# Altium schematic sheet MCU.schdoc
size 425 x 281 mm
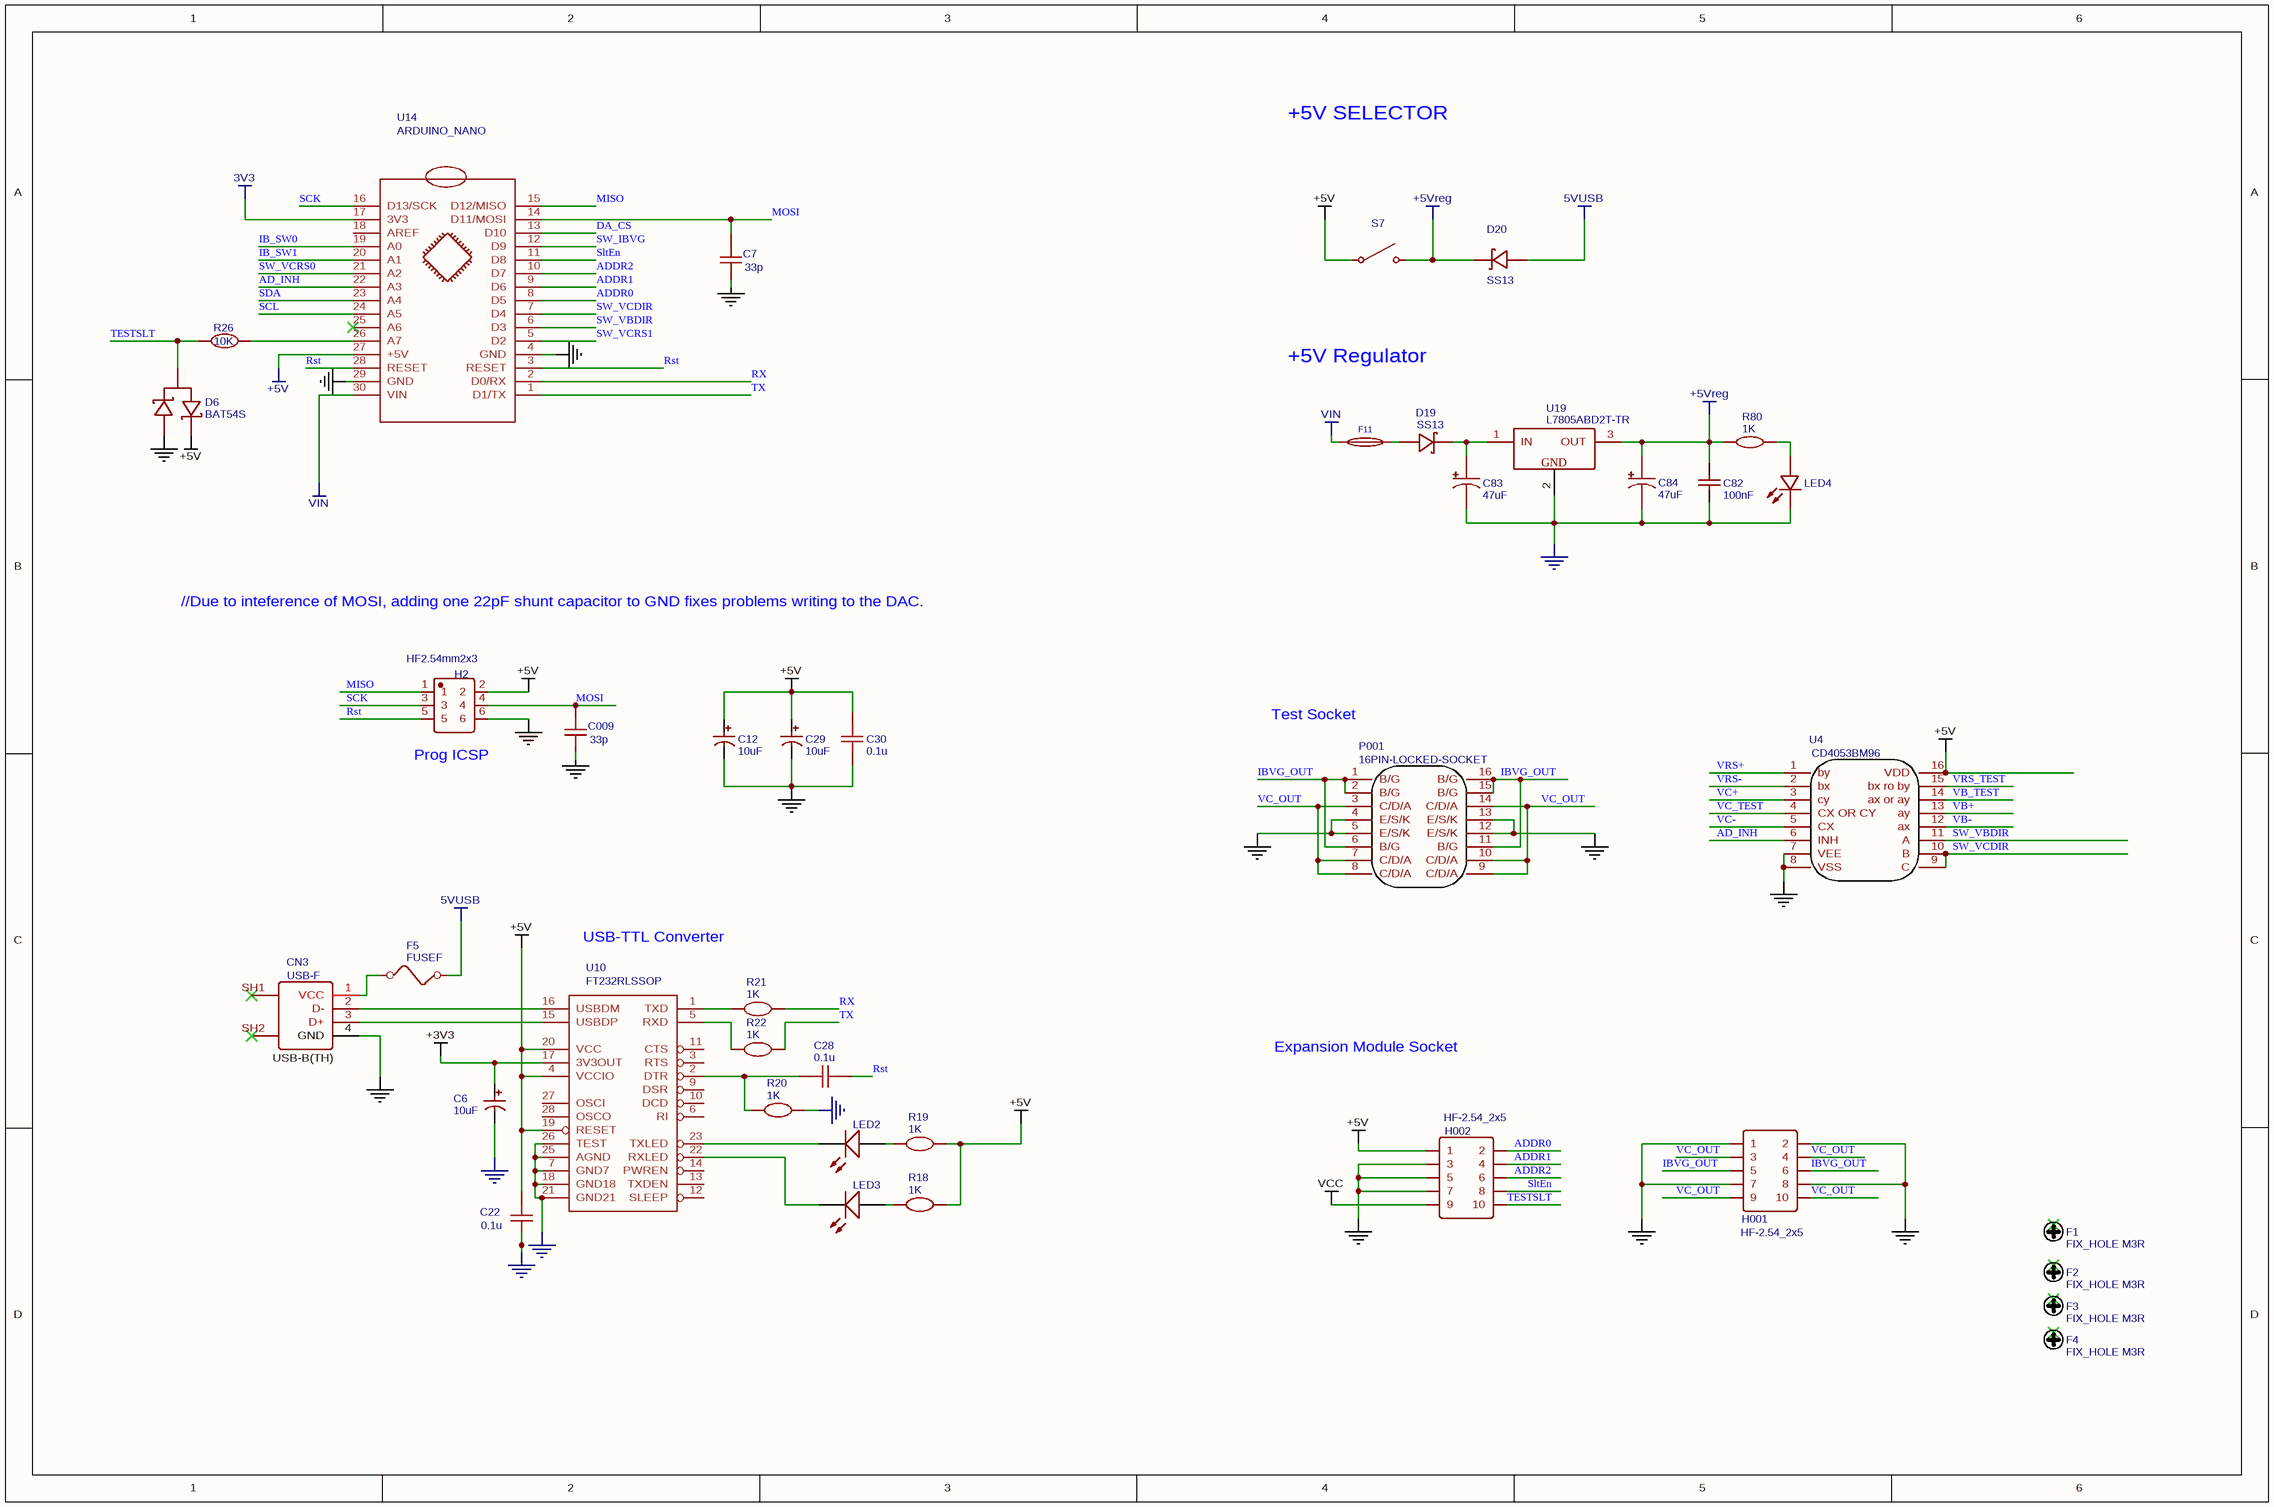
[diagram p0: MCU.schdoc]

## Parts
C6  10uF  [C0805]
C7  33p  [C0805]
C009  33p  [C0805]
C12  10uF  [C0805]
C22  0.1u  [C0805]
C28  0.1u  [C0805]
C29  10uF  [C0805]
C30  0.1u  [C0805]
C82  100nF  [C0603]
C83  47uF  [CAP-SMD_BD6.3-L6.6-W6.6-FD]
C84  47uF  [CAP-SMD_BD6.3-L6.6-W6.6-FD]
CN3  USB-F  [USB-B_4PIN-FEMALE_BF90]
D6  BAT54S  [SOT-23(SOT-23-3)]
D19  SS13  [SMA(DO-214AC)]
D20  SS13  [SMA(DO-214AC)]
F1  FIX_HOLE M3R  [FIXHOLE_M3R]
F2  FIX_HOLE M3R  [FIXHOLE_M3R]
F3  FIX_HOLE M3R  [FIXHOLE_M3R]
F4  FIX_HOLE M3R  [FIXHOLE_M3R]
F5  FUSEF  [1812]
F11  SCT500MA  [FUSE-SMD_L6.1-W2.6]  (value not drawn)
H001  HF-2.54_2x5  [HDR-TH_10P-P2.54-V-R2-C5-S2.54]
H002  HF-2.54_2x5  [HDR-TH_10P-P2.54-V-R2-C5-S2.54]
H2  HF2.54mm2x3  [HDR-TH_6P-P2.54-V-R2-C3-S2.54]
LED2  17-21/GHC-YR1S2/3T  [LED-0805]  (value not drawn)
LED3  17-21/GHC-YR1S2/3T  [LED-0805]  (value not drawn)
LED4  ON  [LED0603-RD]  (value not drawn)
P001  16PIN-LOCKED-SOCKET  [16PIN-LOCKED-SOCKET]
R18  1K  [R0805_NEW]
R19  1K  [R0805_NEW]
R20  1K  [R0805_NEW]
R21  1K  [R0805_NEW]
R22  1K  [R0805_NEW]
R26  10K  [R0805]
R80  1K  [R0603]
S7  SPST_Open  (value not drawn)
U4  CD4053BM96  [SOIC-16_L9.9-W3.9-P1.27-LS6.0-BL]
U10  FT232RLSSOP  [SSOP28DB]
U14  ARDUINO_NANO  [ARDUINO_NANO]
U19  L7805ABD2T-TR  [TO-263-2_L10.0-W9.2-P5.08-LS15.3-TL-CW]

## Nets
3V3: U14.17(3V3)
5VUSB: D20.1(A) F5.2
+3V3: C6.1 U10.17(3V3OUT)
+5V: C12.1 C22.2 C29.1 C30.2 D6.2(K2) H002.1 H2.2 R18.2 R19.2 S7.1 U4.16(VDD) U10.4(VCCIO) U10.19(RESET) U10.20(VCC) U14.27(+5V)
+5Vreg: C82.2 C84.1 D20.2(K) R80.1 S7.2 U19.3(OUT)
GND: C6.2 C7.1 C009.1 C12.2 C22.1 C29.2 C30.1 C82.1 C83.2 C84.2 CN3.4(GND) D6.1(A1) H001.1 H001.2 H001.7 H001.8 H002.3 H002.5 H2.6 H002.7 LED4.1(K) P001.4(E/S/K) P001.5(E/S/K) P001.12(E/S/K) P001.13(E/S/K) R20.2 U4.7(VEE) U4.8(VSS) U10.7(GND7) U10.18(GND18) U10.21(GND21) U10.25(AGND) U10.26(TEST) U14.4(GND) U14.29(GND) U19.2(GND)
VCC: H002.9
VIN: F11.1 U14.30(VIN)
AD_INH: U4.6(INH) U14.22(A3)
ADDR0: H002.2 U14.8(D5)
ADDR1: H002.4 U14.9(D6)
ADDR2: H002.6 U14.10(D7)
DA_CS: U14.13(D10)
IB_SW0: U14.19(A0)
IB_SW1: U14.20(A1)
IBVG_OUT: H001.5 H001.6 P001.1(B/G) P001.2(B/G) P001.6(B/G) P001.11(B/G) P001.15(B/G) P001.16(B/G)
MISO: H2.1 U14.15(D12/MISO)
MOSI: C7.2 C009.2 H2.4 U14.14(D11/MOSI)
Rst: C28.1 H2.5 U14.3(RESET) U14.28(RESET)
RX: R21.2 U14.2(D0/RX)
SCK: H2.3 U14.16(D13/SCK)
SCL: U14.24(A5)
SDA: U14.23(A4)
SltEn: H002.8 U14.11(D8)
SW_IBVG: U14.12(D9)
SW_VBDIR: U4.11(A) U14.6(D3)
SW_VCDIR: U4.9(C) U4.10(B) U14.7(D4)
SW_VCRS0: U14.21(A2)
SW_VCRS1: U14.5(D2)
TESTSLT: D6.3(A) H002.10 R26.1
TX: R22.2 U14.1(D1/TX)
VB+: U4.13(ay)
VB-: U4.12(ax)
VB_TEST: U4.14(ax_or_ay)
VC+: U4.3(cy)
VC-: U4.5(CX)
VC_OUT: H001.3 H001.4 H001.9 H001.10 P001.3(C/D/A) P001.7(C/D/A) P001.8(C/D/A) P001.9(C/D/A) P001.10(C/D/A) P001.14(C/D/A)
VC_TEST: U4.4(CX_OR_CY)
VRS+: U4.1(by)
VRS-: U4.2(bx)
VRS_TEST: U4.15(bx_ro_by)
NetC28_2: C28.2 R20.1 U10.2(DTR)
NetC83_1: C83.1 D19.2(K) U19.1(IN)
NetCN3_1: CN3.1(VCC) F5.1
NetCN3_2: CN3.2(D-) U10.16(USBDM)
NetCN3_3: CN3.3(D+) U10.15(USBDP)
NetD19_1: D19.1(A) F11.2
NetLED2_1: LED2.1(A) R19.1
NetLED2_2: LED2.2(C) U10.23(TXLED)
NetLED3_1: LED3.1(A) R18.1
NetLED3_2: LED3.2(C) U10.22(RXLED)
NetLED4_2: LED4.2(A) R80.2
NetR21_1: R21.1 U10.1(TXD)
NetR22_1: R22.1 U10.5(RXD)
NetR26_2: R26.2 U14.26(A7)

Not connected (* = marked no-connect by the designer): CN3 SH1* SH2*; F1 0*; F2 0*; F3 0*; F4 0*; U10 3(RTS) 6(RI) 9(DSR) 10(DCD) 11(CTS) 12(SLEEP) 13(TXDEN) 14(PWREN) 27(OSCI) 28(OSCO); U14 18(AREF) 25(A6)*

## Notes on the sheet
- +5V SELECTOR
- +5V Regulator
- //Due to inteference of MOSI, adding one 22pF shunt capacitor to GND fixes problems writing to the DAC.
- Test Socket
- (near H2) Prog ICSP
- USB-TTL Converter
- Expansion Module Socket
- (in symbol USB-F) USB-B(TH)

## Library data of the parts
C6 C12 C29 = 10uF: BOM_Manufacturer: ValuePro; BOM_Manufacturer Part: 10uF 16V 3*5; nameAlias: Capacitance; BOM_Supplier: LCSC; BOM_Supplier Part: C43798; spicePre: C; spiceSymbolName: 10uF 16V 3*5
C7 C009 = 33p: nameAlias: Value(F); spicePre: C; spiceSymbolName: Cap_0805_US
C22 C28 C30 = 0.1u: nameAlias: Value(F); spicePre: C; spiceSymbolName: Cap_0805_US
C82 = 100nF: BOM_Manufacturer: Prosperity Dielectrics; BOM_Manufacturer Part: FN18X104K250PSG; nameAlias: Capacitance; Contributor: LCSC; BOM_Supplier: LCSC; BOM_Supplier Part: C235730; spicePre: C; spiceSymbolName: FN18X104K250PSG
C83 C84 = 47uF: BOM_Manufacturer: Vertical Technology; BOM_Manufacturer Part: VT1E470M-CRE54; nameAlias: Capacitance; Contributor: LCSC; BOM_Supplier: LCSC; BOM_Supplier Part: C294515; spicePre: C; spiceSymbolName: VT1E470M-CRE54
CN3 = USB-F: BOM_Manufacturer Part: USB-B-Female-90-TH; BOM_Supplier: LCSC; image: //image.lceda.cn/szlcsc/C46393.jpg; BOM_Supplier Part: C46393; spicePre: C; spiceSymbolName: USB-B-Female-TH_C46393
D6 = BAT54S: BOM_Manufacturer: SEMTECH; SMT Type: Extend; BOM_Supplier: LCSC; BOM_Manufacturer Part: BAT54S; image: //image.lceda.cn/szlcsc/C83935.jpg; BOM_Supplier Part: C83935; BOM_LCSC Assembly: Yes; spicePre: D
D19 D20 = SS13: BOM_Manufacturer: MDD; BOM_Supplier: LCSC; BOM_Manufacturer Part: SS13; spicePre: D; BOM_Supplier Part: C64984
F1-F4 = FIX_HOLE M3R: Contributor: JM共享库; spicePre: F; spiceSymbolName: FIX_HOLE M3R
F11 = SCT500MA: BOM_Manufacturer: TLC Electronic; Contributor: LCSC; BOM_Supplier: LCSC; BOM_Supplier Part: C312001; BOM_Manufacturer Part: SCT500mA; spicePre: F; spiceSymbolName: SCT500MA
H001 H002 = HF-2.54_2x5: BOM_Manufacturer: Ckmtw; BOM_Manufacturer Part: 220S-2*5P H=8.5MM Ytype Gold-plated; BOM_Supplier: LCSC; BOM_Supplier Part: C124423; spicePre: H; spiceSymbolName: Header-Female-2.54_2x5
H2 = HF2.54mm2x3: BOM_Manufacturer: ReliaPro; BOM_Manufacturer Part: Female header/2.54mm2x3 Female header; BOM_Supplier Part: C47552; BOM_Supplier: LCSC; spicePre: H; spiceSymbolName: Female header/2.54mm2x3 Female header
LED2 LED3 = 17-21/GHC-YR1S2/3T: BOM_Manufacturer: EVERLIGHT; BOM_Supplier: EasyEDA; BOM_Manufacturer Part: 17-21/GHC-YR1S2/3T; spicePre: L; BOM_Supplier Part: E73546
LED4 = ON: BOM_Manufacturer: Bright LED Elec; BOM_Manufacturer Part: BL-HKC36P-TRB; Contributor: LCSC; BOM_Supplier: LCSC; BOM_Supplier Part: C138542; spicePre: L; spiceSymbolName: BL-HKC36P-TRB
P001 = 16PIN-LOCKED-SOCKET: Contributor: XTX_AE; spicePre: P
R18-R22 = 1K: nameAlias: Value(Ω); spicePre: R; spiceSymbolName: Res_0805(1/8W)_EU
R26 = 10K: nameAlias: Value(Ω); spicePre: R; spiceSymbolName: Res_0805(1/8W)_EU
R80 = 1K: BOM_Manufacturer: Hong Kong Resistors; BOM_Manufacturer Part: RCT031KJLF; nameAlias: Resistance (Ohms); Contributor: LCSC; BOM_Supplier: LCSC; BOM_Supplier Part: C177343; spicePre: R; spiceSymbolName: RCT031KJLF
S7 = SPST_Open: nameAlias: Model; catid: 20; State: Open; Contributor: EasyEDA; NameDisplay: 0; spiceSymbolName: SPST; spicePre: X
U4 = CD4053BM96: BOM_Manufacturer: TI; SMT Type: Basic; BOM_Supplier: LCSC; BOM_Manufacturer Part: CD4053BM96; BOM_LCSC Assembly: Yes; image: //image.lceda.cn/szlcsc/C6742.jpg; BOM_Supplier Part: C6742; spicePre: U; spiceSymbolName: CD4053BM96
U10 = FT232RLSSOP: Contributor: SparkFun; BOM_Manufacturer Part: ?; spicePre: U
U14 = ARDUINO_NANO: sourceId: KGSeAWhDB; timeStamp: 1452340004; BOM_Manufacturer Part: ?; spicePre: U
U19 = L7805ABD2T-TR: BOM_Manufacturer: STMicroelectronics; BOM_Supplier: LCSC; BOM_Manufacturer Part: L7805ABD2T-TR; BOM_Supplier Part: C86206; BOM_JLCPCB Part Class: Extended Part; spicePre: U; spiceSymbolName: L7805ABD2T-TR
F5 = FUSEF: BOM_Manufacturer Part: ?; spicePre: F